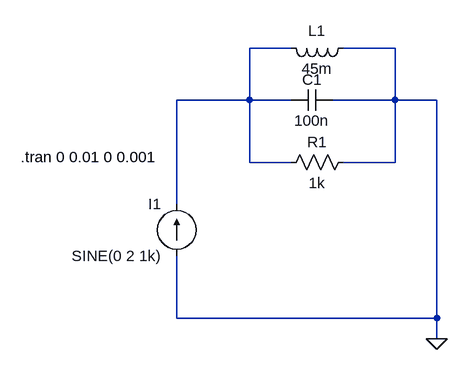
[diagram p0: schematic R_L_C__L.asc]
R_L_C__L.asc, the LTspice schematic file:
Version 4
SHEET 1 880 680
WIRE 208 -32 144 -32
WIRE 368 -32 288 -32
WIRE 144 48 144 -32
WIRE 144 48 32 48
WIRE 208 48 144 48
WIRE 368 48 368 -32
WIRE 368 48 272 48
WIRE 432 48 368 48
WIRE 144 144 144 48
WIRE 208 144 144 144
WIRE 368 144 368 48
WIRE 368 144 288 144
WIRE 32 208 32 48
WIRE 32 384 32 288
WIRE 432 384 432 48
WIRE 432 384 32 384
WIRE 432 416 432 384
FLAG 432 416 0
SYMBOL cap 272 32 R90
WINDOW 0 0 32 VBottom 2
WINDOW 3 32 32 VTop 2
SYMATTR InstName C1
SYMATTR Value 100n
SYMBOL res 304 128 R90
WINDOW 0 0 56 VBottom 2
WINDOW 3 32 56 VTop 2
SYMATTR InstName R1
SYMATTR Value 1k
SYMBOL ind 304 -48 R90
WINDOW 0 5 56 VBottom 2
WINDOW 3 32 56 VTop 2
SYMATTR InstName L1
SYMATTR Value 45m
SYMBOL current 32 288 R180
WINDOW 0 24 80 Left 2
WINDOW 3 24 0 Left 2
WINDOW 123 0 0 Left 0
WINDOW 39 0 0 Left 0
SYMATTR InstName I1
SYMATTR Value SINE(0 2 1k)
TEXT -208 136 Left 2 !.tran 0 0.01 0 0.001

The netlist it stands for:
* R_L_C__L.asc
C1 0 N001 100n
R1 0 N001 1k
L1 0 N001 45m
I1 0 N001 SINE(0 2 1k)
.tran 0 0.01 0 0.001
.backanno
.end